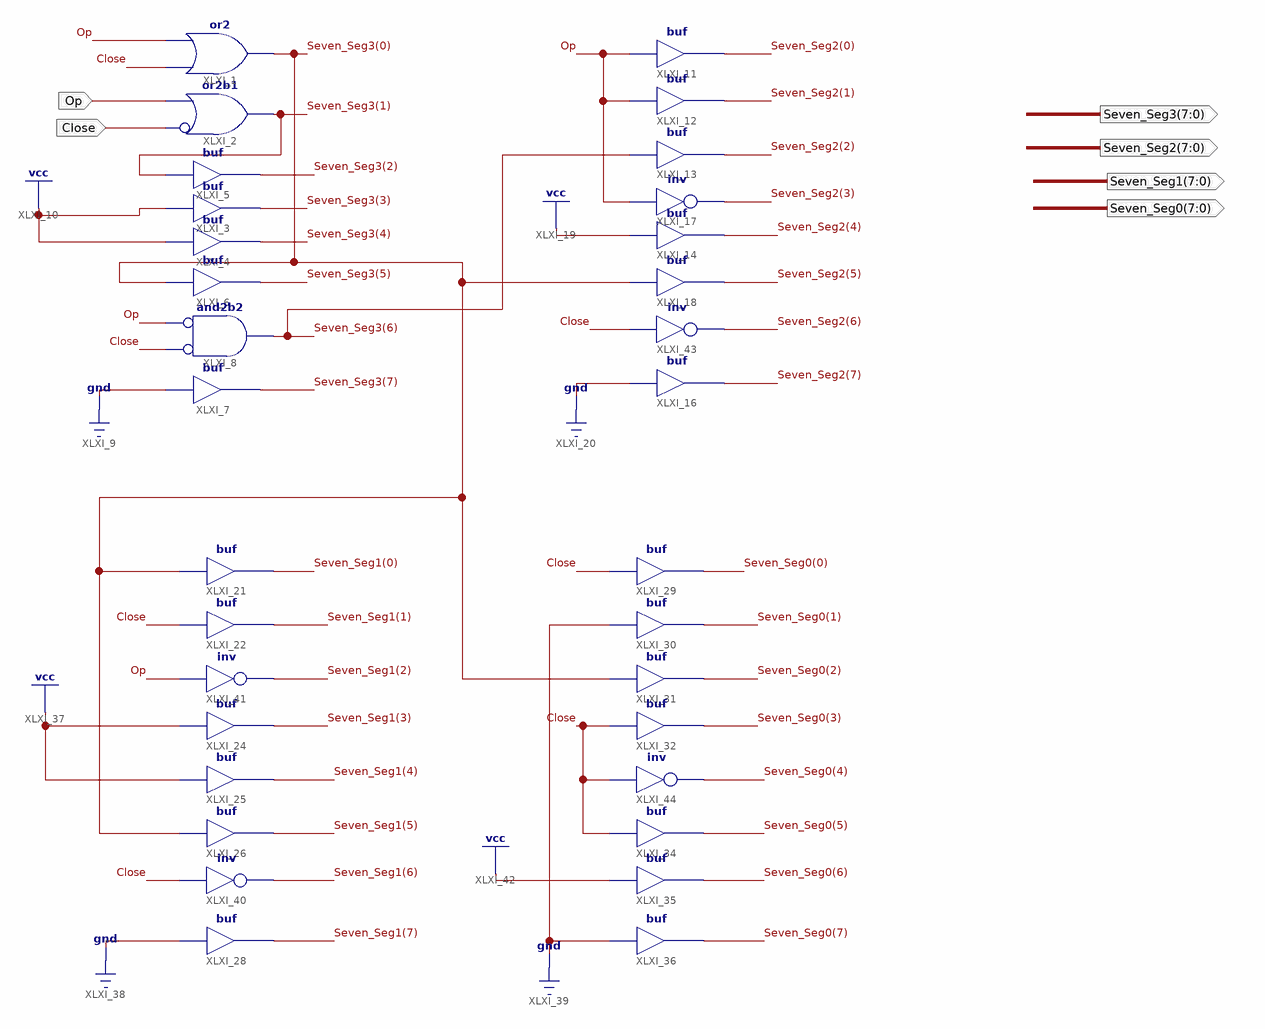
[diagram p0: schematic sheet 1]
// Xilinx ISE schematic Ver_Op_Clos.sch (spartan6) as structural Verilog: 32 symbols, 6 ports
module Ver_Op_Clos (
  input  Op,
  input  Close,
  output [7:0] Seven_Seg3,
  output [7:0] Seven_Seg2,
  output [7:0] Seven_Seg1,
  output [7:0] Seven_Seg0
);

  or XLXI_1 (Seven_Seg3[0], Close, Op);
  or XLXI_2 (Seven_Seg3[1], ~Close, Op);  // or2b1
  buf XLXI_3 (Seven_Seg3[3], 1'b1);
  buf XLXI_4 (Seven_Seg3[4], 1'b1);
  buf XLXI_5 (Seven_Seg3[2], Seven_Seg3[1]);
  buf XLXI_6 (Seven_Seg3[5], Seven_Seg3[0]);
  buf XLXI_7 (Seven_Seg3[7], 1'b0);
  and XLXI_8 (Seven_Seg3[6], ~Close, ~Op);  // and2b2
  buf XLXI_11 (Seven_Seg2[0], Op);
  buf XLXI_12 (Seven_Seg2[1], Op);
  buf XLXI_13 (Seven_Seg2[2], Seven_Seg3[6]);
  buf XLXI_14 (Seven_Seg2[4], 1'b1);
  buf XLXI_16 (Seven_Seg2[7], 1'b0);
  not XLXI_17 (Seven_Seg2[3], Op);
  buf XLXI_18 (Seven_Seg2[5], Seven_Seg3[0]);
  buf XLXI_21 (Seven_Seg1[0], Seven_Seg3[0]);
  buf XLXI_22 (Seven_Seg1[1], Close);
  buf XLXI_24 (Seven_Seg1[3], 1'b1);
  buf XLXI_25 (Seven_Seg1[4], 1'b1);
  buf XLXI_26 (Seven_Seg1[5], Seven_Seg3[0]);
  buf XLXI_28 (Seven_Seg1[7], 1'b0);
  buf XLXI_29 (Seven_Seg0[0], Close);
  buf XLXI_30 (Seven_Seg0[1], 1'b0);
  buf XLXI_31 (Seven_Seg0[2], Seven_Seg3[0]);
  buf XLXI_32 (Seven_Seg0[3], Close);
  buf XLXI_34 (Seven_Seg0[5], Close);
  buf XLXI_35 (Seven_Seg0[6], 1'b1);
  buf XLXI_36 (Seven_Seg0[7], 1'b0);
  not XLXI_40 (Seven_Seg1[6], Close);
  not XLXI_41 (Seven_Seg1[2], Op);
  not XLXI_43 (Seven_Seg2[6], Close);
  not XLXI_44 (Seven_Seg0[4], Close);
endmodule
